# Altium schematic sheet CD4007_with_mux.SchDoc: CD4007 with mux
size A3
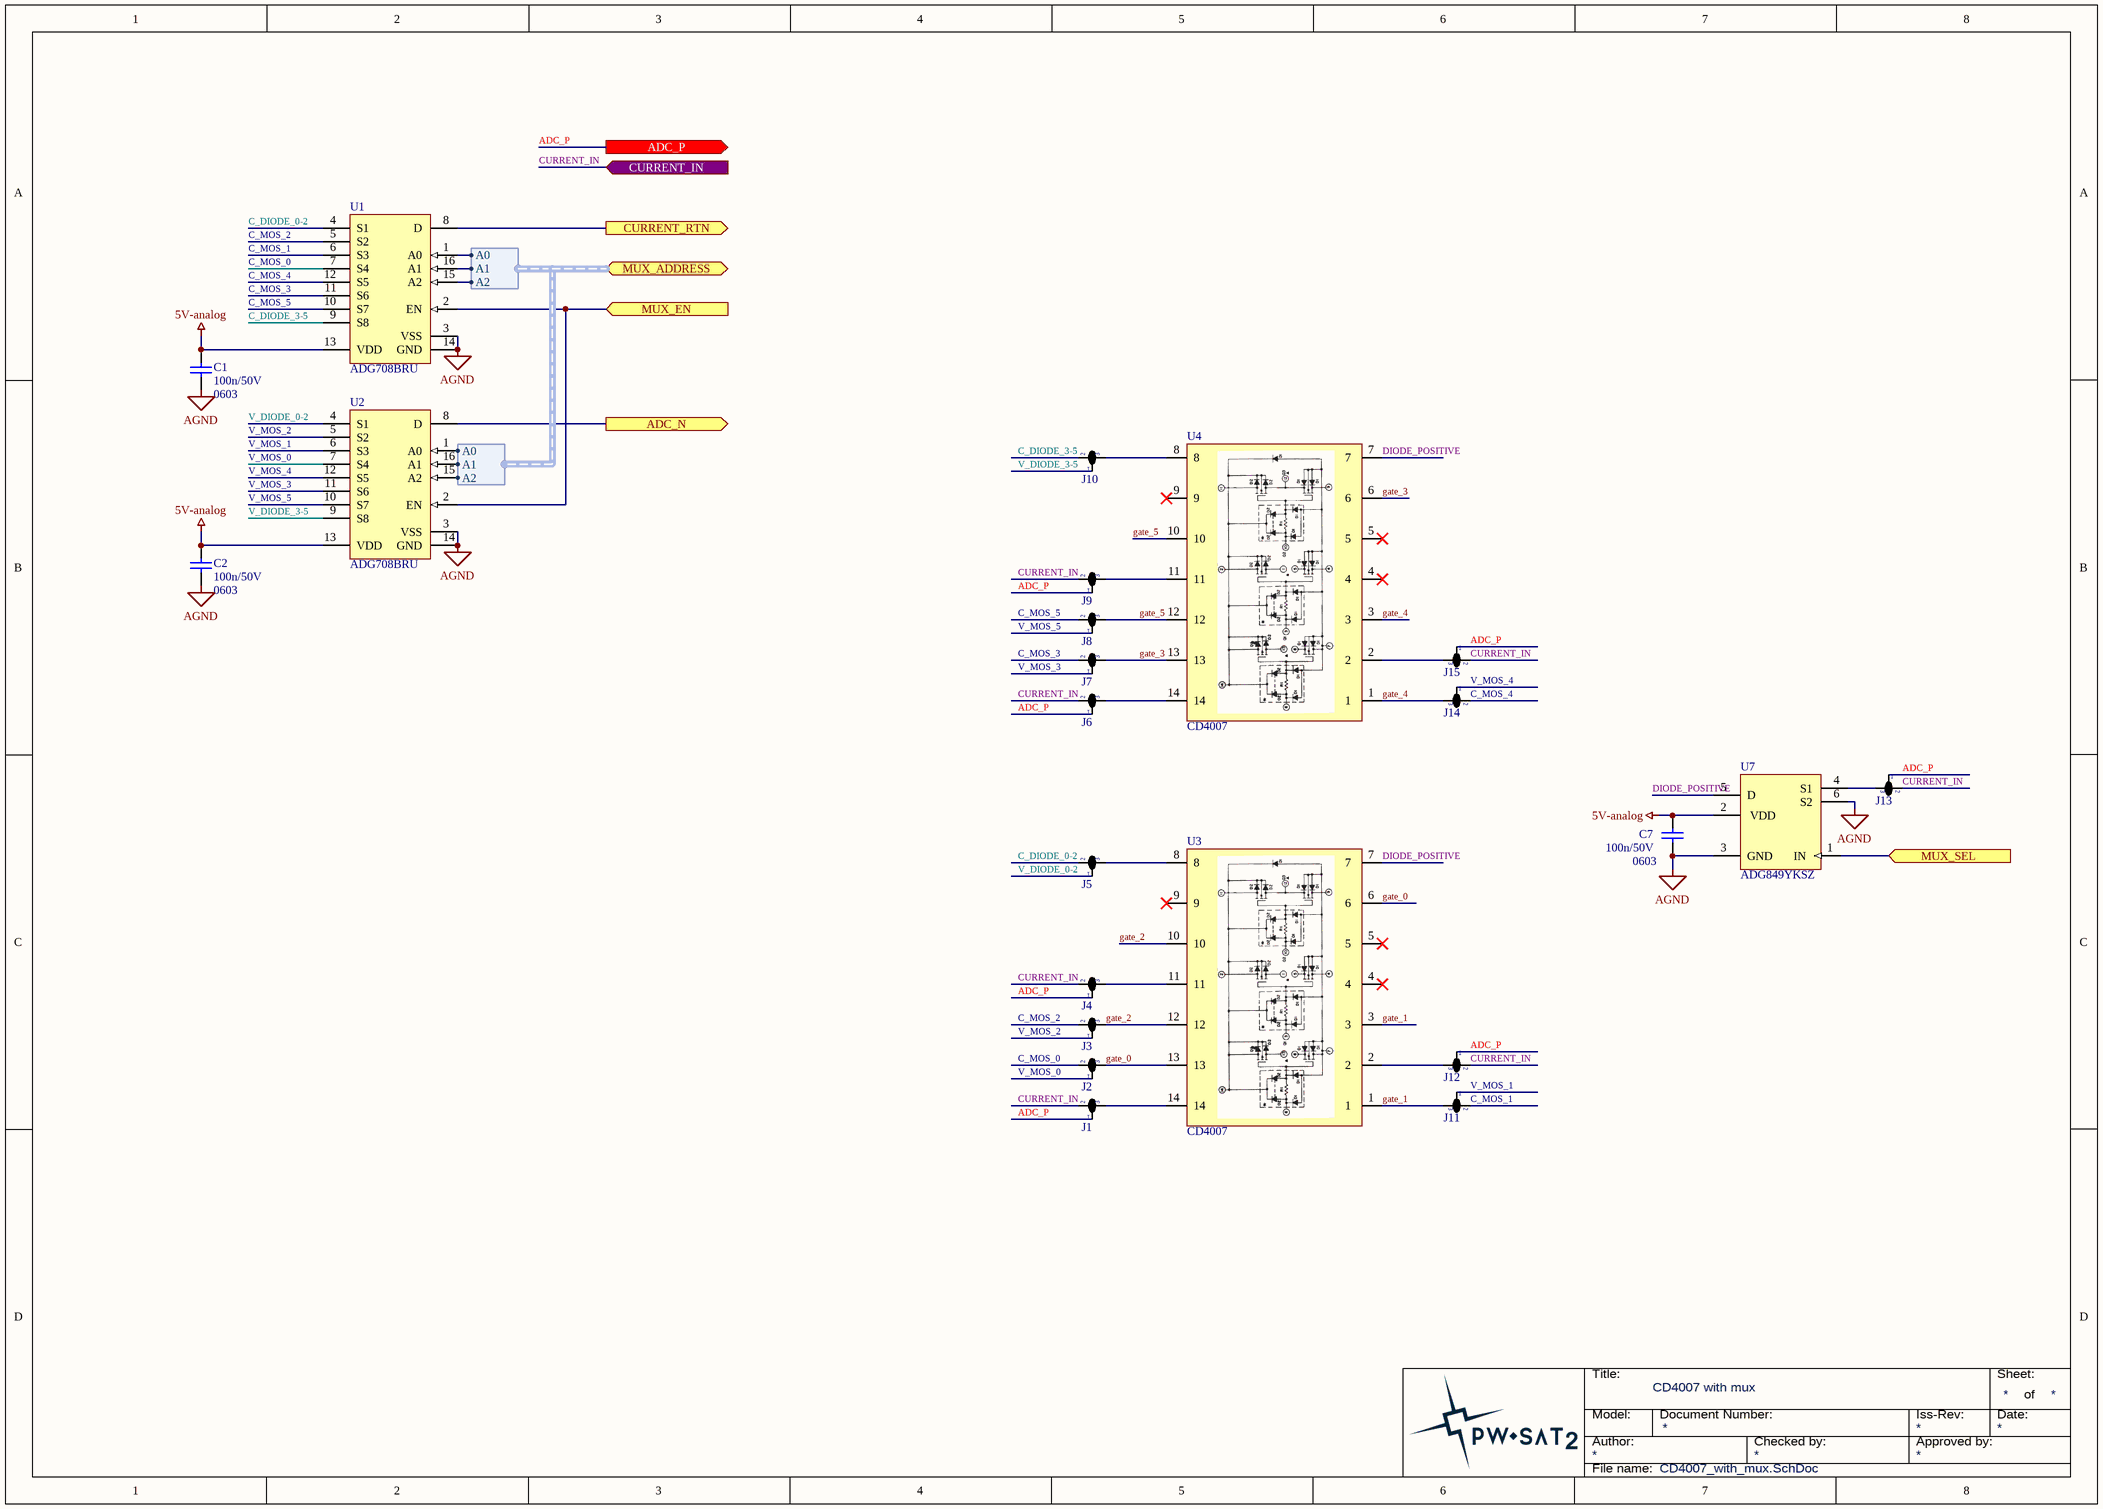
[diagram p0: CD4007_with_mux.SchDoc]

## Parts
C1  Package: 0603  [SMD_Capacitor_0603]  (hidden comment: 100n/50V)
C2  Package: 0603  [SMD_Capacitor_0603]  (hidden comment: 100n/50V)
C7  Package: 0603  [SMD_Capacitor_0603]  (hidden comment: 100n/50V)
J1  3 way net tie junction T shape  [3WaySplitter-RadFET - Test]  (value not drawn)  (net tie, no BOM)
J2  3 way net tie junction T shape  [3WaySplitter-RadFET - Test]  (value not drawn)  (net tie, no BOM)
J3  3 way net tie junction T shape  [3WaySplitter-RadFET - Test]  (value not drawn)  (net tie, no BOM)
J4  3 way net tie junction T shape  [3WaySplitter-RadFET - Test]  (value not drawn)  (net tie, no BOM)
J5  3 way net tie junction T shape  [3WaySplitter-RadFET - Test]  (value not drawn)  (net tie, no BOM)
J6  3 way net tie junction T shape  [3WaySplitter-RadFET - Test]  (value not drawn)  (net tie, no BOM)
J7  3 way net tie junction T shape  [3WaySplitter-RadFET - Test]  (value not drawn)  (net tie, no BOM)
J8  3 way net tie junction T shape  [3WaySplitter-RadFET - Test]  (value not drawn)  (net tie, no BOM)
J9  3 way net tie junction T shape  [3WaySplitter-RadFET - Test]  (value not drawn)  (net tie, no BOM)
J10  3 way net tie junction T shape  [3WaySplitter-RadFET - Test]  (value not drawn)  (net tie, no BOM)
J11  3 way net tie junction T shape  [3WaySplitter-RadFET - Test]  (value not drawn)  (net tie, no BOM)
J12  3 way net tie junction T shape  [3WaySplitter-RadFET - Test]  (value not drawn)  (net tie, no BOM)
J13  3 way net tie junction T shape  [3WaySplitter-RadFET - Test]  (value not drawn)  (net tie, no BOM)
J14  3 way net tie junction T shape  [3WaySplitter-RadFET - Test]  (value not drawn)  (net tie, no BOM)
J15  3 way net tie junction T shape  [3WaySplitter-RadFET - Test]  (value not drawn)  (net tie, no BOM)
U1  ADG708BRU  [ADI-RU-16_N]
U2  ADG708BRU  [ADI-RU-16_N]
U3  CD4007  [TSSOP14]
U4  CD4007  [TSSOP14]
U7  ADG849YKSZ  [SC70-LT6_N]

## Ports
ADC_N (out), ADC_P (out), CURRENT_IN (in), CURRENT_RTN (out), MUX_ADDRESS (harness MUX_Address), MUX_EN (in), MUX_SEL (in)

## Harnesses
MUX_Address: A0, A1, A2

## Nets
5V-analog: C1.1 C2.1 C7.1 U1.13(VDD) U2.13(VDD) U7.2(VDD)
AGND: C1.2 C2.2 C7.2 U1.3(VSS) U1.14(GND) U2.3(VSS) U2.14(GND) U7.3(GND) U7.6(S2)
ADC_N: U2.8(D) ; port ADC_N
ADC_P: J1.1 J4.1 J6.1 J9.1 J12.1 J13.1 J15.1 ; port ADC_P
C_DIODE_0-2: J5.2 U1.4(S1)
C_DIODE_3-5: J10.2 U1.9(S8)
C_MOS_0: J2.2 U1.7(S4)
C_MOS_1: J11.2 U1.6(S3)
C_MOS_2: J3.2 U1.5(S2)
C_MOS_3: J7.2 U1.11(S6)
C_MOS_4: J14.2 U1.12(S5)
C_MOS_5: J8.2 U1.10(S7)
CURRENT_IN: J1.2 J4.2 J6.2 J9.2 J12.2 J13.2 J15.2 ; port CURRENT_IN
CURRENT_RTN: U1.8(D) ; port CURRENT_RTN
DIODE_POSITIVE: U3.7 U4.7 U7.5(D)
gate_0: J2.3 U3.6 U3.13
gate_1: J11.3 U3.1 U3.3
gate_2: J3.3 U3.10 U3.12
gate_3: J7.3 U4.6 U4.13
gate_4: J14.3 U4.1 U4.3
gate_5: J8.3 U4.10 U4.12
MUX_EN: U1.2(EN) U2.2(EN) ; port MUX_EN
MUX_SEL: U7.1(IN) ; port MUX_SEL
V_DIODE_0-2: J5.1 U2.4(S1)
V_DIODE_3-5: J10.1 U2.9(S8)
V_MOS_0: J2.1 U2.7(S4)
V_MOS_1: J11.1 U2.6(S3)
V_MOS_2: J3.1 U2.5(S2)
V_MOS_3: J7.1 U2.11(S6)
V_MOS_4: J14.1 U2.12(S5)
V_MOS_5: J8.1 U2.10(S7)
NetJ1_3: J1.3 U3.14
NetJ4_3: J4.3 U3.11
NetJ5_3: J5.3 U3.8
NetJ6_3: J6.3 U4.14
NetJ9_3: J9.3 U4.11
NetJ10_3: J10.3 U4.8
NetJ12_3: J12.3 U3.2
NetJ13_3: J13.3 U7.4(S1)
NetJ15_3: J15.3 U4.2
NetU1_1: U1.1(A0) U2.1(A0) ; port MUX_ADDRESS.A0
NetU1_15: U1.15(A2) U2.15(A2) ; port MUX_ADDRESS.A2
NetU1_16: U1.16(A1) U2.16(A1) ; port MUX_ADDRESS.A1

Not connected (* = marked no-connect by the designer): U3 4* 5* 9*; U4 4* 5* 9*

## Notes on the sheet
- Title:
- Sheet:
- of
- Author:
- Model:
- Document Number:
- Checked by:
- Iss-Rev:
- Approved by:
- Date:
- File name:

## Library data of the parts
C1 C2 C7 = Cer_C0603T104K5RALTU: Ceramic Cap Kemet COTS 100n/50V X7R 0603; Manufacturer: Kemet; ManufacturerPartNumber: C0603T104K5RALTU; Value: 100n/50V
J1-J15 = 3wayT-RadFET: Note: 2 display modes available; ComponentLink1URL: http://www.edatools.cz/addons; ComponentLink1Description: Source; FootprintNote: LP=12mil, MP=40mil, HP=120mil
U1 U2 = ADG708BRU: 1.8 to 5.5 V / +/-2.5 V, CMOS Low Voltage 3 Ohm, 8-Channel Multiplexer, -40 to 125 degC, 16-pin SOP (RU-16), Tube; Manufacturer: Analog Devices; Bandwidth (Hz): 55M; Max Analog Signal Range: Vss to Vdd; Ron (ohms): 3; Supply V Guar Performance: Dual_(+/-2.5V), Single_(+3V), Single_(+5V); t transition (s): 14n; DatasheetVersion: Rev. C; PackageVersion: Nov-02; PackageReference: RU-16; PackageDescription: 16-Pin Thin Shrink Small Outline Package, Body 5 x 4.4 mm, Pitch 0.65 mm; Supplier 1: Digi-Key; Supplier Part Number 1: ADG708BRU-ND; Supplier 2: Mouser; Supplier Part Number 2: 584-ADG708BRU; Packing: Tube; Mounting Technology: Surface Mount; Code_JEDEC: MO-153AB; PartNumber: ADG708BRU; ComponentLink1Description: Manufacturer URL; ComponentLink1URL: http://www.analog.com/en/index.html; ComponentLink2Description: Datasheet; ComponentLink2URL: http://www.analog.com/static/imported-files/data_sheets/ADG708_709.pdf; ComponentLink3Description: Package Specification; ComponentLink3URL: http:/www.analog.com/static/imported-files/packages/36244347913743854010197452789RU16.pdf
U3 U4 = CD4007: CMOS Dual Complementary Pair Plus Inverter; ComponentLink1URL: http://www.mouser.com/catalog/specsheets/AT45DB041D.pdf; ComponentLink1Description: Datasheet
U7 = ADG849YKSZ: CMOS Analog switch; Manufacturer: Analog Devices; ManufacturerPartNumber: ADG849YKSZ